# EAGLE schematic maple-audio-r1 (EAGLE 5.04)

## Sheet 1 of 3
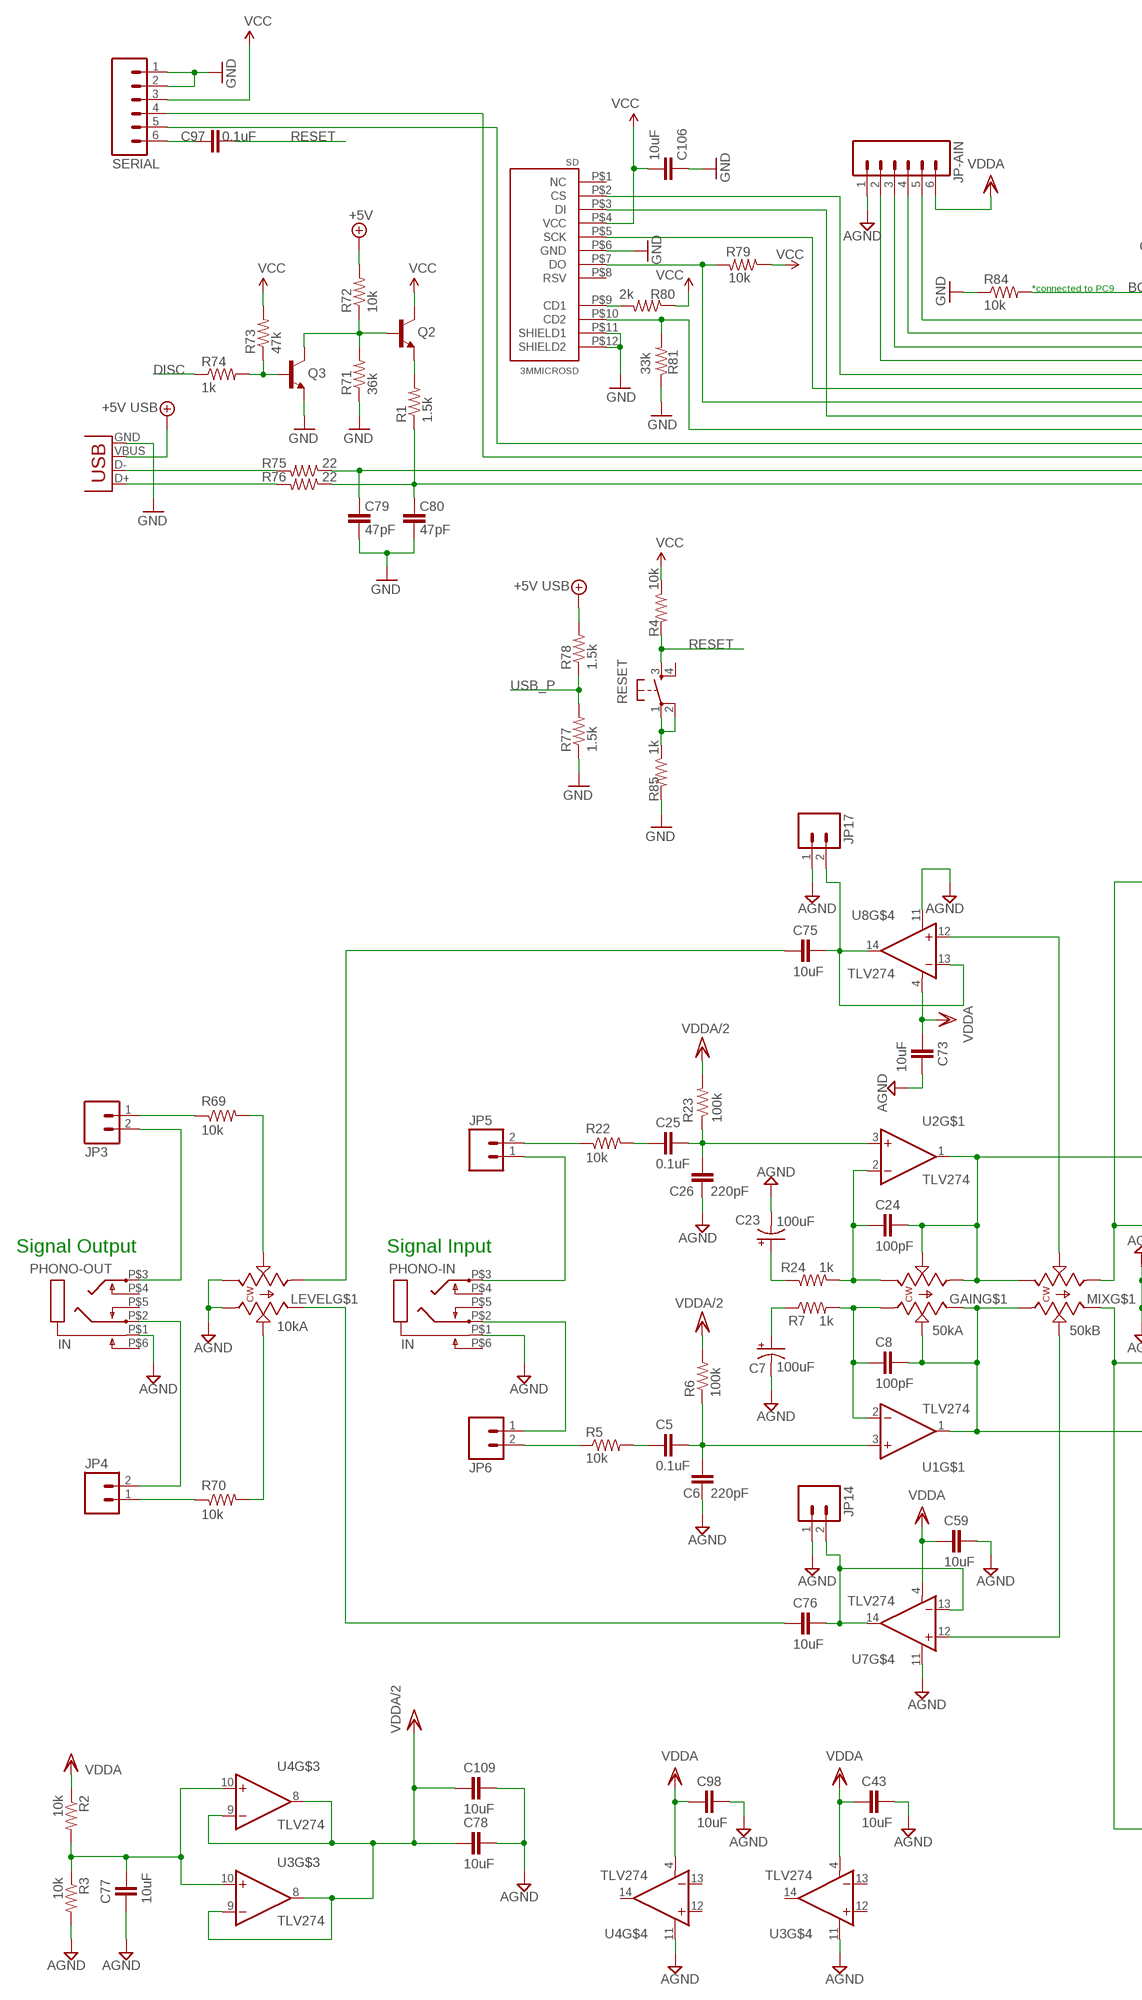
[diagram p0: schematic, sheet 1, part 1 of 2]
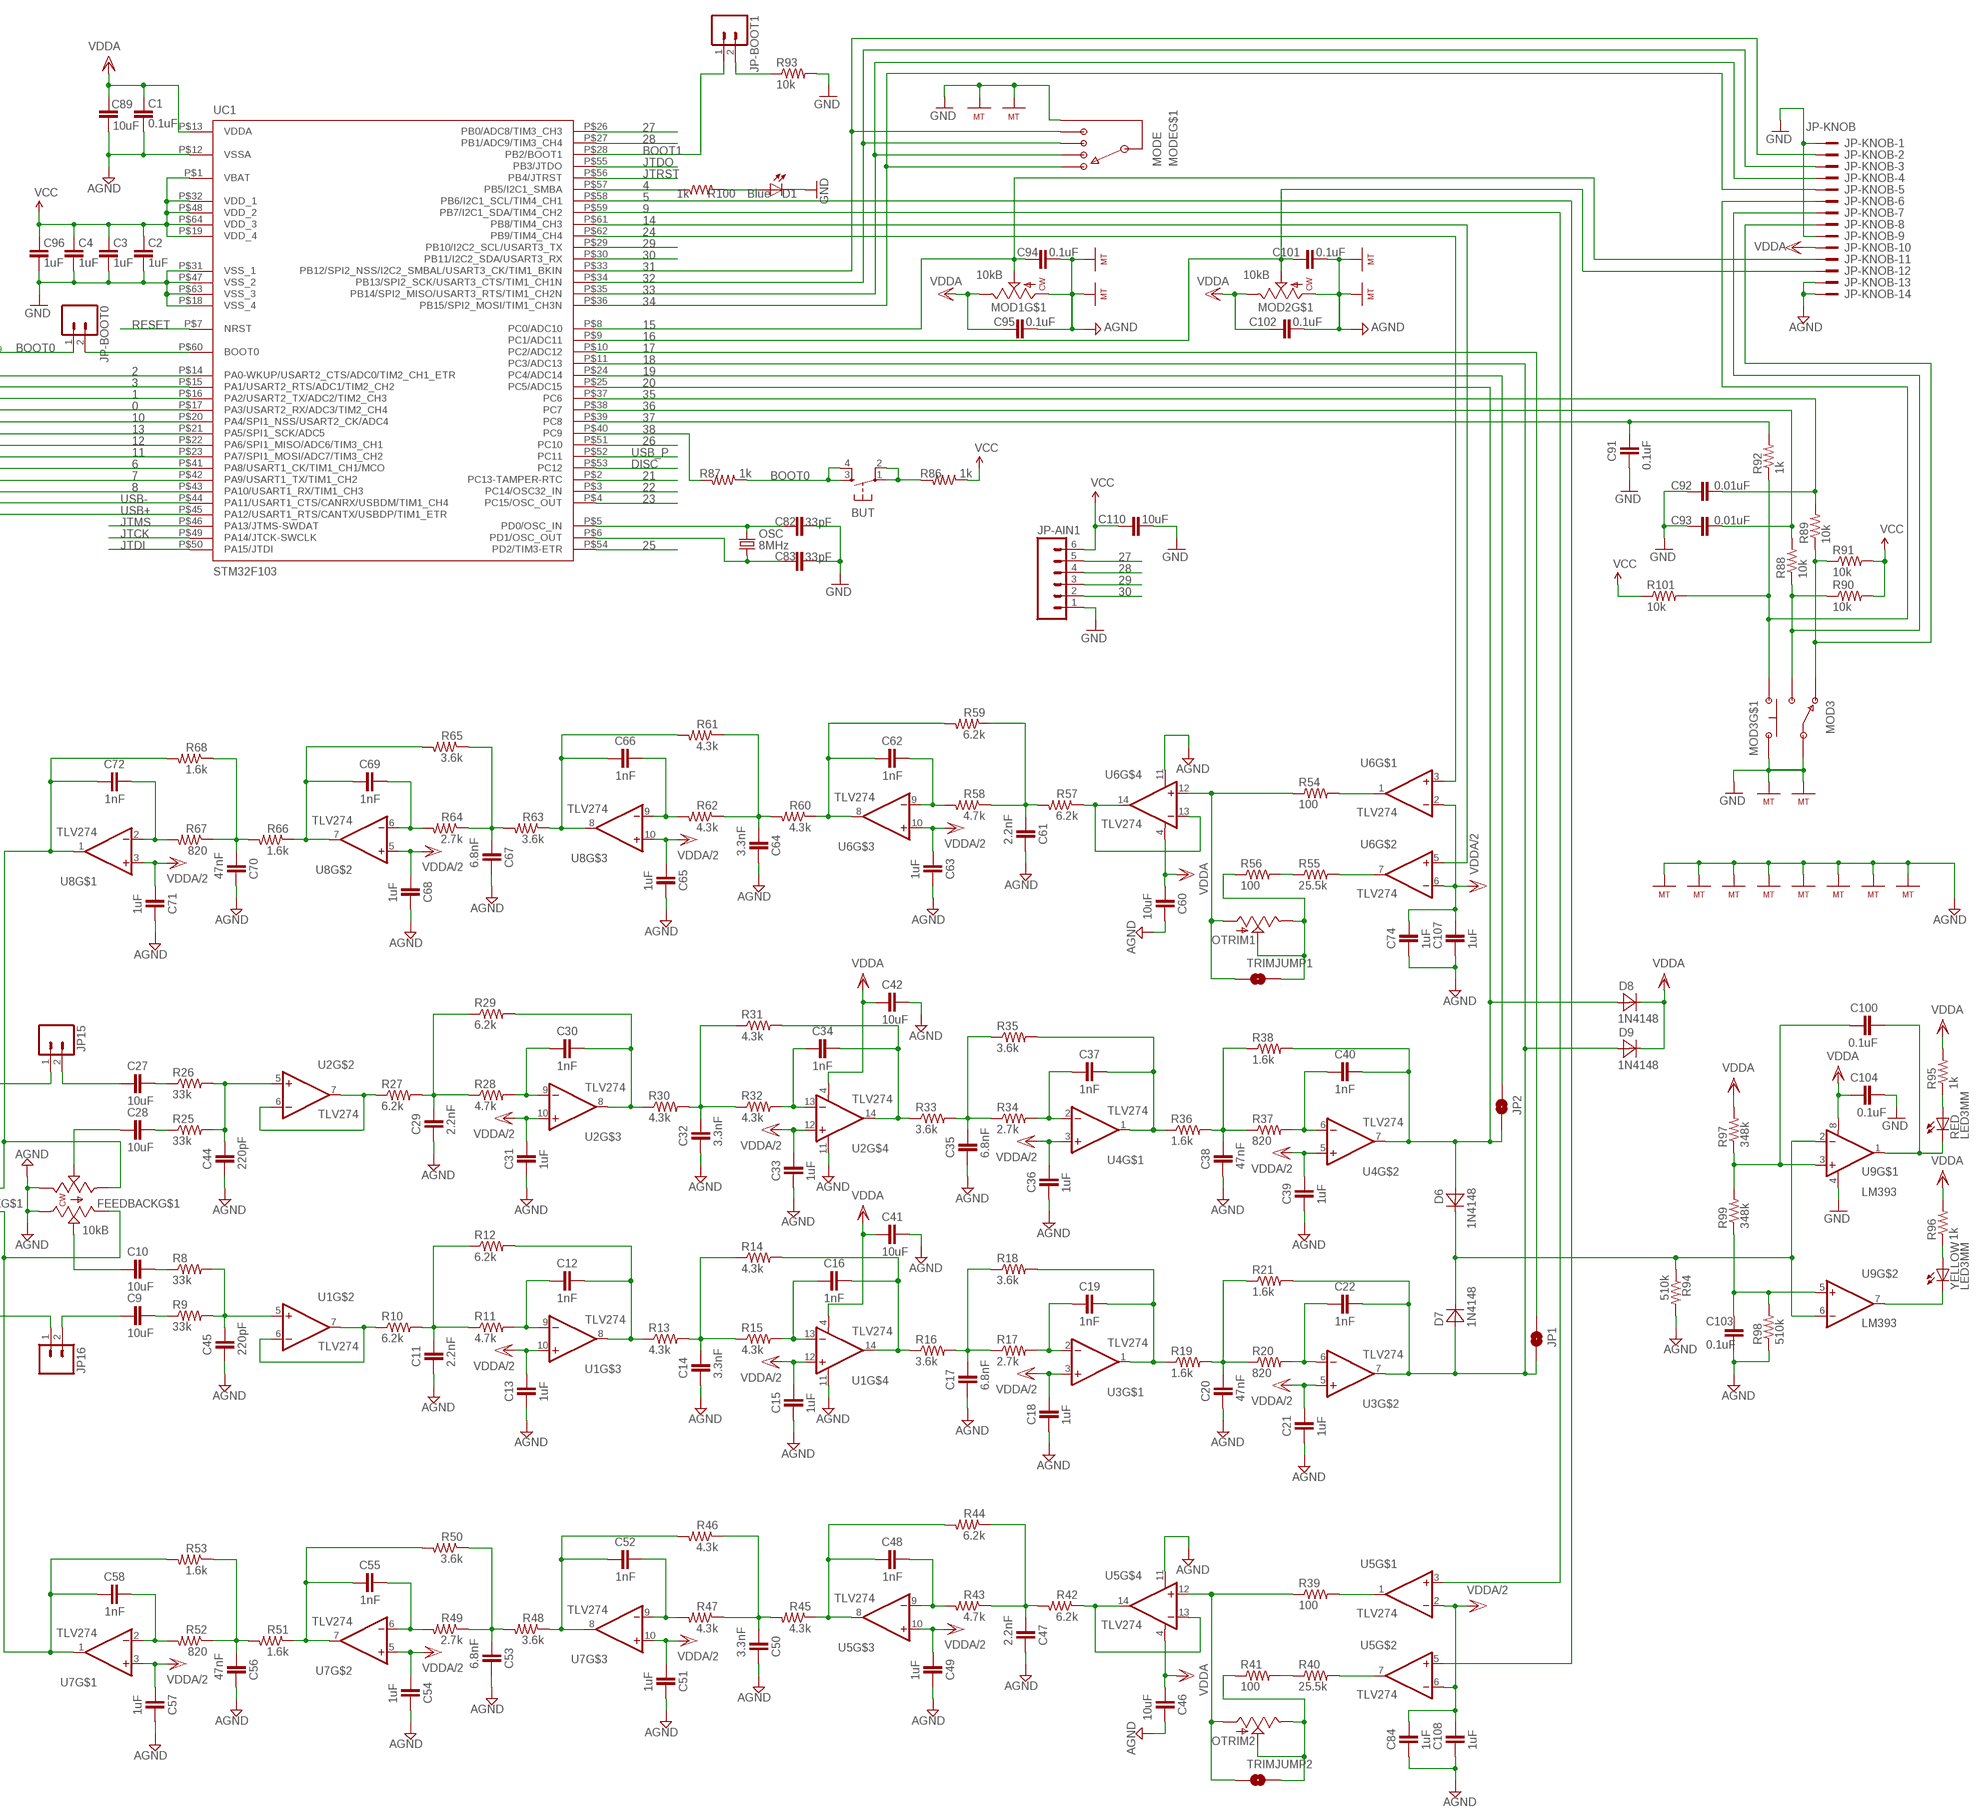
[diagram p1: schematic, sheet 1, part 2 of 2]

### Parts
BUT  TAC_SWITCHPTH  [TACTILE-PTH]
C1  0.1uF  CAP0402  [C0402]
C2  1uF  CAP0402  [C0402]
C3  1uF  CAP0402  [C0402]
C4  1uF  CAP0402  [C0402]
C5  0.1uF  CAPACITOR0805  [0805A]
C6  220pF  CAPACITOR0805  [0805A]
C7  100uF  CAPACITOR-POL  [3528-21]
C8  100pF  CAPACITOR0805  [0805A]
C9  10uF  CAPACITOR0805  [0805A]
C10  10uF  CAPACITOR0805  [0805A]
C11  2.2nF  CAPACITOR0805  [0805A]
C12  1nF  CAPACITOR0805  [0805A]
C13  1uF  CAPACITOR0805  [0805A]
C14  3.3nF  CAPACITOR0805  [0805A]
C15  1uF  CAPACITOR0805  [0805A]
C16  1nF  CAPACITOR0805  [0805A]
C17  6.8nF  CAPACITOR0805  [0805A]
C18  1uF  CAPACITOR0805  [0805A]
C19  1nF  CAPACITOR0805  [0805A]
C20  47nF  CAPACITOR0805  [0805A]
C21  1uF  CAPACITOR0805  [0805A]
C22  1nF  CAPACITOR0805  [0805A]
C23  100uF  CAPACITOR-POL  [3528-21]
C24  100pF  CAPACITOR0805  [0805A]
C25  0.1uF  CAPACITOR0805  [0805A]
C26  220pF  CAPACITOR0805  [0805A]
C27  10uF  CAPACITOR0805  [0805A]
C28  10uF  CAPACITOR0805  [0805A]
C29  2.2nF  CAPACITOR0805  [0805A]
C30  1nF  CAPACITOR0805  [0805A]
C31  1uF  CAPACITOR0805  [0805A]
C32  3.3nF  CAPACITOR0805  [0805A]
C33  1uF  CAPACITOR0805  [0805A]
C34  1nF  CAPACITOR0805  [0805A]
C35  6.8nF  CAPACITOR0805  [0805A]
C36  1uF  CAPACITOR0805  [0805A]
C37  1nF  CAPACITOR0805  [0805A]
C38  47nF  CAPACITOR0805  [0805A]
C39  1uF  CAPACITOR0805  [0805A]
C40  1nF  CAPACITOR0805  [0805A]
C41  10uF  CAPACITOR0805  [0805A]
C42  10uF  CAPACITOR0805  [0805A]
C43  10uF  CAPACITOR0805  [0805A]
C44  220pF  CAPACITOR0805  [0805A]
C45  220pF  CAPACITOR0805  [0805A]
C46  10uF  CAPACITOR0805  [0805A]
C47  2.2nF  CAPACITOR0805  [0805A]
C48  1nF  CAPACITOR0805  [0805A]
C49  1uF  CAPACITOR0805  [0805A]
C50  3.3nF  CAPACITOR0805  [0805A]
C51  1uF  CAPACITOR0805  [0805A]
C52  1nF  CAPACITOR0805  [0805A]
C53  6.8nF  CAPACITOR0805  [0805A]
C54  1uF  CAPACITOR0805  [0805A]
C55  1nF  CAPACITOR0805  [0805A]
C56  47nF  CAPACITOR0805  [0805A]
C57  1uF  CAPACITOR0805  [0805A]
C58  1nF  CAPACITOR0805  [0805A]
C59  10uF  CAPACITOR0805  [0805A]
C60  10uF  CAPACITOR0805  [0805A]
C61  2.2nF  CAPACITOR0805  [0805A]
C62  1nF  CAPACITOR0805  [0805A]
C63  1uF  CAPACITOR0805  [0805A]
C64  3.3nF  CAPACITOR0805  [0805A]
C65  1uF  CAPACITOR0805  [0805A]
C66  1nF  CAPACITOR0805  [0805A]
C67  6.8nF  CAPACITOR0805  [0805A]
C68  1uF  CAPACITOR0805  [0805A]
C69  1nF  CAPACITOR0805  [0805A]
C70  47nF  CAPACITOR0805  [0805A]
C71  1uF  CAPACITOR0805  [0805A]
C72  1nF  CAPACITOR0805  [0805A]
C73  10uF  CAPACITOR0805  [0805A]
C74  1uF  CAPACITOR0805  [0805A]
C75  10uF  CAPACITOR0805  [0805A]
C76  10uF  CAPACITOR0805  [0805A]
C77  10uF  CAPACITOR0805  [0805A]
C78  10uF  CAPACITOR0805  [0805A]
C79  47pF  CAP0402  [C0402]
C80  47pF  CAP0402  [C0402]
C82  33pF  CAP0402  [C0402]
C83  33pF  CAP0402  [C0402]
C84  1uF  CAPACITOR0805  [0805A]
C89  10uF  CAPACITOR0805  [0805A]
C91  0.1uF  CAPACITOR0805  [0805A]
C92  0.01uF  CAPACITOR0805  [0805A]
C93  0.01uF  CAPACITOR0805  [0805A]
C94  0.1uF  CAPACITOR0805  [0805A]
C95  0.1uF  CAPACITOR0805  [0805A]
C96  1uF  CAP0402  [C0402]
C97  0.1uF  CAP0402  [C0402]
C98  10uF  CAPACITOR0805  [0805A]
C100  0.1uF  CAPACITOR0805  [0805A]
C101  0.1uF  CAPACITOR0805  [0805A]
C102  0.1uF  CAPACITOR0805  [0805A]
C103  0.1uF  CAPACITOR0805  [0805A]
C104  0.1uF  CAPACITOR0805  [0805A]
C106  10uF  C-EUC0805  [C0805]
C107  1uF  CAPACITOR0805  [0805A]
C108  1uF  CAPACITOR0805  [0805A]
C109  10uF  CAPACITOR0805  [0805A]
C110  10uF  CAPACITOR0805  [0805A]
D1  Blue  LED3MM  [LED3MM]
D6  1N4148  DIODESOD-123  [SOD-123]
D7  1N4148  DIODESOD-123  [SOD-123]
D8  1N4148  DIODESOD-123  [SOD-123]
D9  1N4148  DIODESOD-123  [SOD-123]
FEEDBACK  10kB  POT-DUALPANASONIC  [POT/DUAL/VERT]
GAIN  50kA  POT-DUALPANASONIC  [POT/DUAL/VERT]
JP1  SOLDERJUMPERTRACE  [SJ_2S-TRACE]
JP2  SOLDERJUMPERTRACE  [SJ_2S-TRACE]
JP3  M02PTH  [1X02]
JP4  M02PTH  [1X02]
JP5  M02PTH  [1X02]
JP6  M02PTH  [1X02]
JP14  M02PTH  [1X02]
JP15  M02PTH  [1X02]
JP16  M02PTH  [1X02]
JP17  M02PTH  [1X02]
JP-AIN  M06SIP  [1X06]
JP-AIN1  M06SIP  [1X06]
JP-BOOT0  M02LOCK  [1X02_LOCK]
JP-BOOT1  M02LOCK  [1X02_LOCK]
JP-KNOB  JP-KNOB  2514-  [PAK100/2500-14]
LEVEL  10kA  POT-DUALPANASONIC  [POT/DUAL/VERT]
MIX  50kB  POT-DUALPANASONIC  [POT/DUAL/VERT]
MOD1  10kB  POTPANASONIC  [POT/SINGLE/PANASONIC]
MOD2  10kB  POTPANASONIC  [POT/SINGLE/PANASONIC]
MOD3  MOD3  ROTARY-ENCODER/SWITCHSWITCH  [ROTARY-ENCODER]
MODE  MODE  ROTARY-ENCODER/BINARYALPHA  [ROTARY-ENCODER/BINARY]
OSC  8MHz  CRYSTAL5X3  [CRYSTAL-SMD-5X3]
OTRIM1  POT100K_3362U  [3362U]
OTRIM2  POT100K_3362U  [3362U]
PHONO-IN  IN  1/4"JACK/STEREO/SWITCHEDNYS-216  [1/4"JACK/STEREO]
PHONO-OUT  IN  1/4"JACK/STEREO/SWITCHEDNYS-216  [1/4"JACK/STEREO]
Q2  TRANSISTOR_NPNSOT23  [SOT23]
Q3  TRANSISTOR_NPNSOT23  [SOT23]
R1  1.5k  RESISTOR0402  [C0402]
R2  10k  R-US_M0805  [M0805]
R3  10k  R-US_M0805  [M0805]
R4  10k  RESISTOR0402  [C0402]
R5  10k  R-US_M0805  [M0805]
R6  100k  R-US_M0805  [M0805]
R7  1k  R-US_M0805  [M0805]
R8  33k  R-US_M0805  [M0805]
R9  33k  R-US_M0805  [M0805]
R10  6.2k  R-US_M0805  [M0805]
R11  4.7k  R-US_M0805  [M0805]
R12  6.2k  R-US_M0805  [M0805]
R13  4.3k  R-US_M0805  [M0805]
R14  4.3k  R-US_M0805  [M0805]
R15  4.3k  R-US_M0805  [M0805]
R16  3.6k  R-US_M0805  [M0805]
R17  2.7k  R-US_M0805  [M0805]
R18  3.6k  R-US_M0805  [M0805]
R19  1.6k  R-US_M0805  [M0805]
R20  820  R-US_M0805  [M0805]
R21  1.6k  R-US_M0805  [M0805]
R22  10k  R-US_M0805  [M0805]
R23  100k  R-US_M0805  [M0805]
R24  1k  R-US_M0805  [M0805]
R25  33k  R-US_M0805  [M0805]
R26  33k  R-US_M0805  [M0805]
R27  6.2k  R-US_M0805  [M0805]
R28  4.7k  R-US_M0805  [M0805]
R29  6.2k  R-US_M0805  [M0805]
R30  4.3k  R-US_M0805  [M0805]
R31  4.3k  R-US_M0805  [M0805]
R32  4.3k  R-US_M0805  [M0805]
R33  3.6k  R-US_M0805  [M0805]
R34  2.7k  R-US_M0805  [M0805]
R35  3.6k  R-US_M0805  [M0805]
R36  1.6k  R-US_M0805  [M0805]
R37  820  R-US_M0805  [M0805]
R38  1.6k  R-US_M0805  [M0805]
R39  100  R-US_M0805  [M0805]
R40  25.5k  R-US_M0805  [M0805]
R41  100  R-US_M0805  [M0805]
R42  6.2k  R-US_M0805  [M0805]
R43  4.7k  R-US_M0805  [M0805]
R44  6.2k  R-US_M0805  [M0805]
R45  4.3k  R-US_M0805  [M0805]
R46  4.3k  R-US_M0805  [M0805]
R47  4.3k  R-US_M0805  [M0805]
R48  3.6k  R-US_M0805  [M0805]
R49  2.7k  R-US_M0805  [M0805]
R50  3.6k  R-US_M0805  [M0805]
R51  1.6k  R-US_M0805  [M0805]
R52  820  R-US_M0805  [M0805]
R53  1.6k  R-US_M0805  [M0805]
R54  100  R-US_M0805  [M0805]
R55  25.5k  R-US_M0805  [M0805]
R56  100  R-US_M0805  [M0805]
R57  6.2k  R-US_M0805  [M0805]
R58  4.7k  R-US_M0805  [M0805]
R59  6.2k  R-US_M0805  [M0805]
R60  4.3k  R-US_M0805  [M0805]
R61  4.3k  R-US_M0805  [M0805]
R62  4.3k  R-US_M0805  [M0805]
R63  3.6k  R-US_M0805  [M0805]
R64  2.7k  R-US_M0805  [M0805]
R65  3.6k  R-US_M0805  [M0805]
R66  1.6k  R-US_M0805  [M0805]
R67  820  R-US_M0805  [M0805]
R68  1.6k  R-US_M0805  [M0805]
R69  10k  R-US_M0805  [M0805]
R70  10k  R-US_M0805  [M0805]
R71  36k  RESISTOR0402  [C0402]
R72  10k  RESISTOR0402  [C0402]
R73  47k  RESISTOR0402  [C0402]
R74  1k  RESISTOR0402  [C0402]
R75  22  RESISTOR0402  [C0402]
R76  22  RESISTOR0402  [C0402]
R77  1.5k  RESISTOR0402  [C0402]
R78  1.5k  RESISTOR0402  [C0402]
R79  10k  R-US_M0805  [M0805]
R80  2k  R-US_M0805  [M0805]
R81  33k  R-US_M0805  [M0805]
R84  10k  RESISTOR0402  [C0402]
R85  1k  RESISTOR0402  [C0402]
R86  1k  RESISTOR0402  [C0402]
R87  1k  RESISTOR0402  [C0402]
R88  10k  RESISTOR0805  [0805A]
R89  10k  RESISTOR0805  [0805A]
R90  10k  RESISTOR0805  [0805A]
R91  10k  RESISTOR0805  [0805A]
R92  1k  RESISTOR0805  [0805A]
R93  10k  RESISTOR0402  [C0402]
R94  510k  RESISTOR0805  [0805A]
R95  1k  RESISTOR0805  [0805A]
R96  1k  RESISTOR0805  [0805A]
R97  348k  RESISTOR0805  [0805A]
R98  510k  RESISTOR0805  [0805A]
R99  348k  RESISTOR0805  [0805A]
R100  1k  RESISTOR0603  [0603]
R101  10k  RESISTOR0805  [0805A]
RED  LED3MM  [LED3MM]
RESET  TAC_SWITCHPTH  [TACTILE-PTH]
SD  3MMICROSD  [3MMICROSD]
SERIAL  M06SMD-FEMALE-V2  [1X06-SMD-FEMALE-V2]
TRIMJUMP1  SOLDERJUMPERNO  [SJ_2S-NO]
TRIMJUMP2  SOLDERJUMPERNO  [SJ_2S-NO]
U1  TLV274  [14-PDIP]
U2  TLV274  [14-PDIP]
U3  TLV274  [14-PDIP]
U4  TLV274  [14-PDIP]
U5  TLV274  [14-PDIP]
U6  TLV274  [14-PDIP]
U7  TLV274  [14-PDIP]
U8  TLV274  [14-PDIP]
U9  LM393  COMPARATOR8-SOIC  [8-SOIC]
UC1  STM32F103  [TQFP-10X10-64]
X1  USBPTH  [USB-B-PTH]
YELLOW  LED3MM  [LED3MM]

### Nets
0: JP-AIN.2 UC1.P$17(PA3/USART2_RX/ADC3/TIM2_CH4)
1: JP-AIN.3 UC1.P$16(PA2/USART2_TX/ADC2/TIM2_CH3)
2: JP-AIN.5 UC1.P$14(PA0-WKUP/USART2_CTS/ADC0/TIM2_CH1_ETR)
3: JP-AIN.4 UC1.P$15(PA1/USART2_RTS/ADC1/TIM2_CH2)
4: R100.1 UC1.P$57(PB5/I2C1_SMBA)
5: U5.5(+IN) UC1.P$58(PB6/I2C1_SCL/TIM4_CH1)
6: R81.2 SD.P$10(CD2) UC1.P$41(PA8/USART1_CK/TIM1_CH1/MCO)
7: SERIAL.5 UC1.P$42(PA9/USART1_TX/TIM1_CH2)
8: SERIAL.4 UC1.P$43(PA10/USART1_RX/TIM1_CH3)
9: U5.3(+IN) UC1.P$59(PB7/I2C1_SDA/TIM4_CH2)
10: SD.P$2(CS) UC1.P$20(PA4/SPI1_NSS/USART2_CK/ADC4)
11: SD.P$3(DI) UC1.P$23(PA7/SPI1_MOSI/ADC7/TIM3_CH2)
12: R79.2 SD.P$7(DO) UC1.P$22(PA6/SPI1_MISO/ADC6/TIM3_CH1)
13: SD.P$5(SCK) UC1.P$21(PA5/SPI1_SCK/ADC5)
14: U6.5(+IN) UC1.P$61(PB8/TIM4_CH3)
15: C94.+ JP-KNOB.11 MOD1.P$1(S) UC1.P$8(PC0/ADC10)
16: C101.+ JP-KNOB.12 MOD2.P$1(S) UC1.P$9(PC1/ADC11)
17: JP1.1 UC1.P$10(PC2/ADC12)
18: C22.+ D7.P$2(A) D9.P$2(A) JP1.2 R21.2 U3.7(OUT) UC1.P$11(PC3/ADC13)
19: JP2.1 UC1.P$24(PC4/ADC14)
20: C40.+ D6.P$2(A) D8.P$2(A) JP2.2 R38.2 U4.7(OUT) UC1.P$25(PC5/ADC15)
21: UC1.P$2(PC13-TAMPER-RTC)
22: UC1.P$3(PC14/OSC32_IN)
23: UC1.P$4(PC15/OSC_OUT)
24: U6.3(+IN) UC1.P$62(PB9/TIM4_CH4)
25: UC1.P$54(PD2/TIM3-ETR)
26: UC1.P$51(PC10)
27: JP-AIN1.5 UC1.P$26(PB0/ADC8/TIM3_CH3)
28: JP-AIN1.4 UC1.P$27(PB1/ADC9/TIM3_CH4)
29: JP-AIN1.3 UC1.P$29(PB10/I2C2_SCL/USART3_TX)
30: JP-AIN1.2 UC1.P$30(PB11/I2C2_SDA/USART3_RX)
31: JP-KNOB.2 MODE.P$4 UC1.P$33(PB12/SPI2_NSS/I2C2_SMBAL/USART3_CK/TIM1_BKIN)
32: JP-KNOB.3 MODE.P$3 UC1.P$34(PB13/SPI2_SCK/USART3_CTS/TIM1_CH1N)
33: JP-KNOB.4 MODE.P$2 UC1.P$35(PB14/SPI2_MISO/USART3_RTS/TIM1_CH2N)
34: JP-KNOB.5 MODE.P$1 UC1.P$36(PB15/SPI2_MOSI/TIM1_CH3N)
35: C92.- R89.- UC1.P$37(PC6)
36: C93.- R88.- UC1.P$38(PC7)
37: C91.- R92.- UC1.P$39(PC8)
38: R87.2 UC1.P$40(PC9)
+5V: R72.2 R78.2 X1.VBUS ; supply symbol labelled +5V USB ; also sheet 2
AGND: JP-AIN.1
BOOT0: BUT.3 BUT.4 JP-BOOT0.1 R84.2 R87.1
BOOT1: JP-BOOT1.1 UC1.P$28(PB2/BOOT1)
DISC: R74.1 UC1.P$53(PC12)
GND [power]: C1.1 C2.1 C3.1 C4.1 C6.- C7.P$2(-) C11.- C13.- C14.- C15.- C17.- C18.- C20.- C21.- C23.P$2(-) C26.- C29.- C31.- C32.- C33.- C35.- C36.- C38.- C39.- C41.+ C42.+ C43.+ C44.- C45.- C46.+ C47.- C49.- C50.- C51.- C53.- C54.- C56.- C57.- C59.+ C60.+ C61.- C63.- C64.- C65.- C67.- C68.- C70.- C71.- C73.+ C74.- C77.- C78.+ C79.1 C80.1 C82.1 C83.1 C84.- C89.- C91.+ C92.+ C93.+ C94.- C95.- C96.1 C98.+ C101.- C102.- C103.+ C104.- C106.1 C107.- C108.- C109.+ C110.- D1.K(C) FEEDBACK.P$4(A) FEEDBACK.P$5(E1) FEEDBACK.P$7(MT) FEEDBACK.P$8(MT) GAIN.P$7(MT) GAIN.P$8(MT) JP14.1 JP17.1 JP-AIN1.1 JP-KNOB.1 JP-KNOB.9 JP-KNOB.13 JP-KNOB.14 LEVEL.P$4(A) LEVEL.P$5(E1) LEVEL.P$7(MT) LEVEL.P$8(MT) MIX.P$7(MT) MIX.P$8(MT) MOD1.P$2(A) MOD1.P$4(MT) MOD1.P$5(MT) MOD2.P$2(A) MOD2.P$4(MT) MOD2.P$5(MT) MOD3.P$1 MOD3.P$4 MOD3.P$6(MT) MOD3.P$7(MT) MODE.P$5 MODE.P$6(MT) MODE.P$7(MT) PHONO-IN.P$1 PHONO-OUT.P$1 Q3.2(E) R3.2 R71.1 R77.1 R81.1 R84.1 R85.2 R93.2 R94.- R98.+ SD.P$6(GND) SD.P$11(SHIELD1) SD.P$12(SHIELD2) SERIAL.1 SERIAL.2 U1.11(V-) U2.11(V-) U3.11(V-) U4.11(V-) U5.11(V-) U6.11(V-) U7.11(V-) U8.11(V-) U9.4(V-) UC1.P$12(VSSA) UC1.P$18(VSS_4) UC1.P$31(VSS_1) UC1.P$47(VSS_2) UC1.P$63(VSS_3) X1.GND ; supply symbol labelled AGND ; also sheet 2,3
JTCK: UC1.P$49(PA14/JTCK-SWCLK) ; also sheet 3
JTDI: UC1.P$50(PA15/JTDI) ; also sheet 3
JTDO: UC1.P$55(PB3/JTDO) ; also sheet 3
JTMS: UC1.P$46(PA13/JTMS-SWDAT) ; also sheet 3
JTRST: UC1.P$56(PB4/JTRST) ; also sheet 3
N$1: C82.2 OSC.3 UC1.P$5(PD0/OSC_IN)
N$2: C5.- R5.2
N$3: C5.+ C6.+ R6.1 U1.3(+IN)
N$4: C7.P$1(+) R7.1
N$5: JP6.2 R5.1
N$6: JP6.1 PHONO-IN.P$2
N$7: C83.2 OSC.1 UC1.P$6(PD1/OSC_OUT)
N$8: C8.- GAIN.P$5(E1) R7.2 U1.2(-IN)
N$9: C10.+ R8.1
N$10: C10.- FEEDBACK.P$6(S1)
N$11: C9.+ R9.1
N$12: C45.+ R8.2 R9.2 U1.5(+IN)
N$13: Q2.2(E) R1.2
N$14: R10.1 U1.6(-IN) U1.7(OUT)
N$15: C11.+ R10.2 R11.1 R12.1
N$16: Q2.1(B) Q3.3(C) R71.2 R72.1
N$17: C12.- R11.2 U1.9(-IN)
N$18: C12.+ R12.2 R13.1 U1.8(OUT)
N$19: C14.+ R13.2 R14.1 R15.1
N$20: C16.- R15.2 U1.13(-IN)
N$21: C16.+ R14.2 R16.1 U1.14(OUT)
N$22: C77.+ R2.2 R3.1 U3.10(+IN) U4.10(+IN)
N$23: C17.+ R16.2 R17.1 R18.1
N$24: R80.2 SD.P$9(CD1)
N$25: C19.- R17.2 U3.2(-IN)
N$26: C19.+ R18.2 R19.1 U3.1(OUT)
N$27: C20.+ R19.2 R20.1 R21.1
N$28: C22.- R20.2 U3.6(-IN)
N$30: C25.- R22.2
N$31: C8.+ GAIN.P$1(A1) GAIN.P$6(S1) JP16.1 MIX.P$5(E1) U1.1(OUT)
N$32: C25.+ C26.+ R23.1 U2.3(+IN)
N$33: C24.+ GAIN.P$2(E) GAIN.P$3(S) JP15.1 MIX.P$4(A) U2.1(OUT)
N$34: C23.P$1(+) R24.1
N$35: C24.- GAIN.P$4(A) R24.2 U2.2(-IN)
N$36: Q3.1(B) R73.1 R74.2
N$37: C28.- FEEDBACK.P$3(S)
N$38: C28.+ R25.1
N$39: C27.+ R26.1
N$40: C44.+ R25.2 R26.2 U2.5(+IN)
N$41: R27.1 U2.6(-IN) U2.7(OUT)
N$42: C29.+ R27.2 R28.1 R29.1
N$43: C30.- R28.2 U2.9(-IN)
N$44: C30.+ R29.2 R30.1 U2.8(OUT)
N$45: C32.+ R30.2 R31.1 R32.1
N$46: C34.- R32.2 U2.13(-IN)
N$47: C34.+ R31.2 R33.1 U2.14(OUT)
N$48: C35.+ R33.2 R34.1 R35.1
N$49: C37.- R34.2 U4.2(-IN)
N$50: C37.+ R35.2 R36.1 U4.1(OUT)
N$51: C38.+ R36.2 R37.1 R38.1
N$52: C40.- R37.2 U4.6(-IN)
N$53: R39.2 U5.1(OUT)
N$54: R40.2 U5.7(OUT)
N$55: R40.1 R41.2
N$56: OTRIM2.P$3(A) R39.1 TRIMJUMP2.1 U5.12(+IN)
N$57: D1.A R100.2
N$58: R42.1 U5.13(-IN) U5.14(OUT)
N$59: C47.+ R42.2 R43.1 R44.1
N$60: C48.- R43.2 U5.9(-IN)
N$61: C48.+ R44.2 R45.1 U5.8(OUT)
N$62: C50.+ R45.2 R46.1 R47.1
N$63: C52.- R47.2 U7.9(-IN)
N$64: C52.+ R46.2 R48.1 U7.8(OUT)
N$65: C53.+ R48.2 R49.1 R50.1
N$66: C55.- R49.2 U7.6(-IN)
N$67: C55.+ R50.2 R51.1 U7.7(OUT)
N$68: C56.+ R51.2 R52.1 R53.1
N$69: C58.- R52.2 U7.2(-IN)
N$70: R55.2 U6.7(OUT)
N$71: R55.1 R56.2
N$72: OTRIM1.P$3(A) R54.1 TRIMJUMP1.1 U6.12(+IN)
N$73: R57.1 U6.13(-IN) U6.14(OUT)
N$74: C61.+ R57.2 R58.1 R59.1
N$75: C62.- R58.2 U6.9(-IN)
N$76: C62.+ R59.2 R60.1 U6.8(OUT)
N$77: C64.+ R60.2 R61.1 R62.1
N$78: C66.- R62.2 U8.9(-IN)
N$79: C66.+ R61.2 R63.1 U8.8(OUT)
N$80: C67.+ R63.2 R64.1 R65.1
N$81: C69.- R64.2 U8.6(-IN)
N$82: C69.+ R65.2 R66.1 U8.7(OUT)
N$83: C70.+ R66.2 R67.1 R68.1
N$84: C72.- R67.2 U8.2(-IN)
N$85: MIX.P$6(S1) U7.12(+IN)
N$86: JP3.1 R69.1
N$87: C75.+ JP17.2 U8.13(-IN) U8.14(OUT)
N$88: C76.- LEVEL.P$1(A1)
N$89: C75.- LEVEL.P$2(E)
N$90: MIX.P$3(S) U8.12(+IN)
N$91: R75.2 X1.D-
N$92: LEVEL.P$3(S) R69.2
N$93: LEVEL.P$6(S1) R70.2
N$94: JP4.2 PHONO-OUT.P$2
N$96: R76.2 X1.D+
N$108 [power]: R85.1 RESET.1 RESET.2
N$109: BUT.1 BUT.2 R86.2
N$110: JP-BOOT0.2 UC1.P$60(BOOT0)
N$113: D6.P$1(C) D7.P$1(C) R94.+ U9.2(-IN) U9.6(-IN)
N$114: C97.2 SERIAL.6
N$115: JP-KNOB.7 MOD3.P$3 R88.+ R90.+
N$116: C103.- R98.- R99.+ U9.5(+IN)
N$117: C100.- RED.K(C) U9.1(OUT)
N$118: U9.7(OUT) YELLOW.K(C)
N$119: R95.+ RED.A
N$120: R96.+ YELLOW.A
N$122: C100.+ R97.+ R99.- U9.3(+IN)
N$124: OTRIM1.P$1(E) OTRIM1.P$2(S) R56.1 TRIMJUMP1.2
N$125: JP-BOOT1.2 R93.1
N$126: OTRIM2.P$1(E) OTRIM2.P$2(S) R41.1 TRIMJUMP2.2
N$127: R54.2 U6.1(OUT)
N$129: C76.+ JP14.2 U7.13(-IN) U7.14(OUT)
N$130: JP3.2 PHONO-OUT.P$3
N$131: JP4.1 R70.1
N$132: JP-KNOB.8 MOD3.P$2 R89.+ R91.+
N$133: JP5.1 PHONO-IN.P$3
N$134: JP5.2 R22.1
N$135: C27.- JP15.2
N$136: C9.- JP16.2
N$146: JP-KNOB.6 MOD3.P$5 R92.+ R101.-
PWMOUT1: C72.+ FEEDBACK.P$2(E) MIX.P$2(E) R68.2 U8.1(OUT)
PWMOUT2: C58.+ FEEDBACK.P$1(A1) MIX.P$1(A1) R53.2 U7.1(OUT)
RESET: C97.1 R4.2 RESET.3 UC1.P$7(NRST) ; also sheet 3
USB+: C80.2 R1.1 R76.1 UC1.P$45(PA12/USART1_RTS/CANTX/USBDP/TIM1_ETR)
USB-: C79.2 R75.1 UC1.P$44(PA11/USART1_CTS/CANRX/USBDM/TIM1_CH4)
USB_P: R77.2 R78.1 UC1.P$52(PC11)
VCC: C2.2 C3.2 C4.2 C96.2 C106.2 C110.+ JP-AIN1.6 Q2.3(C) R4.1 R73.2 R79.1 R80.1 R86.1 R90.- R91.- R101.+ SD.P$4(VCC) SERIAL.3 UC1.P$1(VBAT) UC1.P$19(VDD_4) UC1.P$32(VDD_1) UC1.P$48(VDD_2) UC1.P$64(VDD_3) ; also sheet 2,3
VCC/2: C13.+ C15.+ C18.+ C21.+ C31.+ C33.+ C36.+ C39.+ C49.+ C51.+ C54.+ C57.+ C63.+ C65.+ C68.+ C71.+ C74.+ C78.- C84.+ C107.+ C108.+ C109.- R6.2 R23.2 U1.10(+IN) U1.12(+IN) U2.10(+IN) U2.12(+IN) U3.3(+IN) U3.5(+IN) U3.8(OUT) U3.9(-IN) U4.3(+IN) U4.5(+IN) U4.8(OUT) U4.9(-IN) U5.2(-IN) U5.6(-IN) U5.10(+IN) U6.2(-IN) U6.6(-IN) U6.10(+IN) U7.3(+IN) U7.5(+IN) U7.10(+IN) U8.3(+IN) U8.5(+IN) U8.10(+IN) ; supply symbol labelled VDDA/2
VDD: C1.2 C41.- C42.- C43.- C46.- C59.- C60.- C73.- C89.+ C95.+ C98.- C102.+ C104.+ D8.P$1(C) D9.P$1(C) JP-AIN.6 JP-KNOB.10 MOD1.P$3(E) MOD2.P$3(E) R2.1 R95.- R96.- R97.- U1.4(V+) U2.4(V+) U3.4(V+) U4.4(V+) U5.4(V+) U6.4(V+) U7.4(V+) U8.4(V+) U9.8(V+) UC1.P$13(VDDA) ; supply symbol labelled VDDA ; also sheet 2
Unconnected: PHONO-IN.P$4 PHONO-IN.P$5 PHONO-IN.P$6 PHONO-OUT.P$4 PHONO-OUT.P$5 PHONO-OUT.P$6 RESET.4 SD.P$1(NC) SD.P$8(RSV) U3.12(+IN) U3.13(-IN) U3.14(OUT) U4.12(+IN) U4.13(-IN) U4.14(OUT)

### Notes on the sheet
- *connected to PC9
- Signal Output | Signal Input

## Sheet 2 of 3
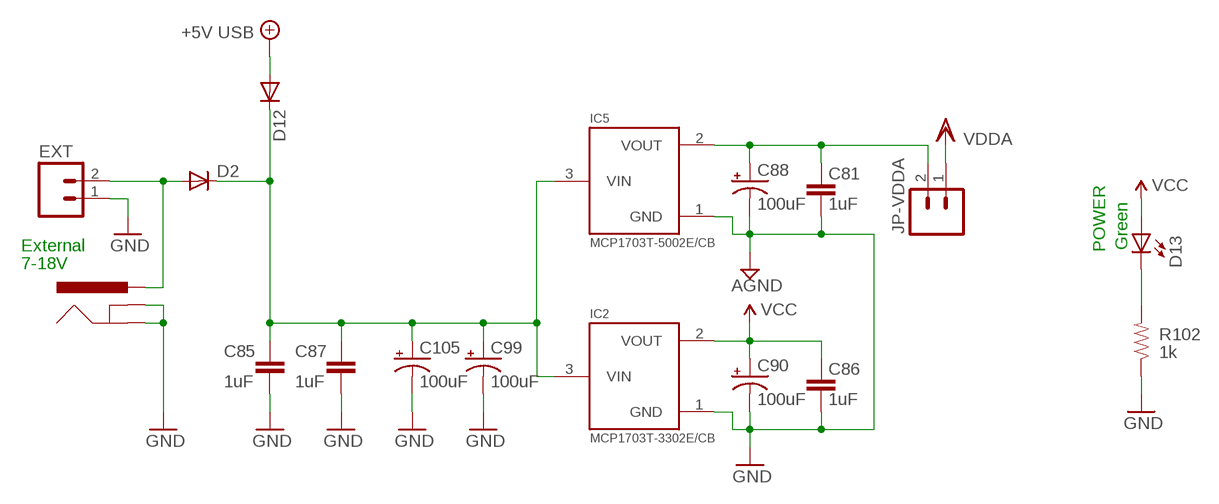
[diagram p2: schematic, sheet 2]

### Parts
C81  1uF  CAP0805  [0805]
C85  1uF  CAP0805  [0805]
C86  1uF  CAP0805  [0805]
C87  1uF  CAP0805  [0805]
C88  100uF  CAP_POLD  [PANASONIC_D]
C90  100uF  CAP_POLD  [PANASONIC_D]
C99  100uF  CAP_POLD  [PANASONIC_D]
C105  100uF  CAP_POLD  [PANASONIC_D]
D2  DIODESMA  [SMA-DIODE]
D12  DIODESMA  [SMA-DIODE]
D13  Green  LED3MM  [LED3MM]
EXT  M02POLAR  [MOLEX-1X2]
EXT-BAR  POWER_JACKPTH  [POWER_JACK_PTH]
IC2  MCP1703T-3302E/CB  MCP1700T  [SOT23]
IC5  MCP1703T-5002E/CB  MCP1700T  [SOT23]
JP-VDDA  M02LOCK  [1X02_LOCK]
R102  1k  RESISTOR0603  [0603]

### Nets
+5V: D12.A ; supply symbol labelled +5V USB ; also sheet 1
GND [power]: C81.1 C85.1 C86.1 C87.1 C88.- C90.- C99.- C105.- EXT-BAR.GND EXT-BAR.GNDBREAK EXT.1 IC2.1(GND) IC5.1(GND) R102.1 ; supply symbol labelled AGND ; also sheet 1,3
N$97 [power]: D2.A EXT-BAR.PWR EXT.2
N$121: C81.2 C88.+ IC5.2(VOUT) JP-VDDA.2
N$137: D13.K(C) R102.2
VCC: C86.2 C90.+ D13.A IC2.2(VOUT) ; also sheet 1,3
VDD: JP-VDDA.1 ; supply symbol labelled VDDA ; also sheet 1
VIN: C85.2 C87.2 C99.+ C105.+ D2.C D12.C IC2.3(VIN) IC5.3(VIN)

### Notes on the sheet
- External | POWER
- 7-18V

## Sheet 3 of 3
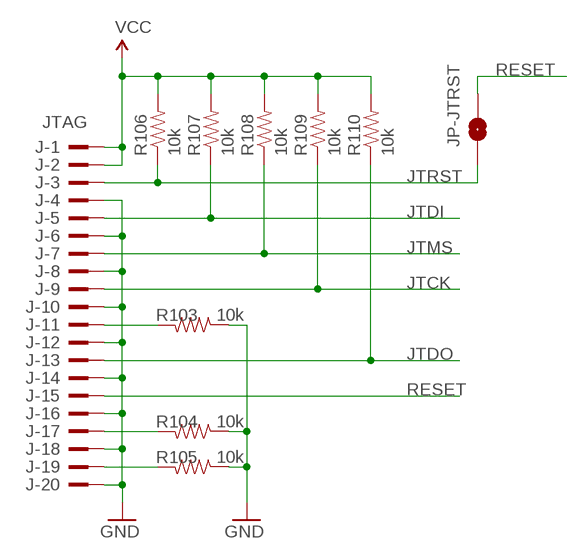
[diagram p3: schematic, sheet 3]

### Parts
J  JTAG  2520-  [PAK100/2500-20]
JP-JTRST  SOLDERJUMPERNO  [SJ_2S-NO]
R103  10k  RESISTOR0402  [C0402]
R104  10k  RESISTOR0402  [C0402]
R105  10k  RESISTOR0402  [C0402]
R106  10k  RESISTOR0402  [C0402]
R107  10k  RESISTOR0402  [C0402]
R108  10k  RESISTOR0402  [C0402]
R109  10k  RESISTOR0402  [C0402]
R110  10k  RESISTOR0402  [C0402]

### Nets
GND [power]: J.4 J.6 J.8 J.10 J.12 J.14 J.16 J.18 J.20 R103.1 R104.1 R105.1 ; also sheet 1,2
JTCK: J.9 R109.1 ; also sheet 1
JTDI: J.5 R107.1 ; also sheet 1
JTDO: J.13 R110.1 ; also sheet 1
JTMS: J.7 R108.1 ; also sheet 1
JTRST: J.3 JP-JTRST.1 R106.1 ; also sheet 1
N$140: J.11 R103.2
N$141: J.17 R104.2
N$142: J.19 R105.2
RESET: J.15 JP-JTRST.2 ; also sheet 1
VCC: J.1 J.2 R106.2 R107.2 R108.2 R109.2 R110.2 ; also sheet 1,2

## Library data of the parts
BUT RESET = SparkFun3:TAC_SWITCH: Momentary Switch Button commonly used for reset or general input. Spark Fun Electronics SKU : COM-00097
C1-C4 C79-C83 C85-C87 C96 C97 = SparkFun:CAP: Capacitor Standard 0603 ceramic capacitor, and 0.1" leaded capacitor.
C5 C6 C8-C22 C24-C78 C84 C89 C91-C95 C98 C100-C104 C107-C110 = audioint:CAPACITOR
C7 C23 = audioint:CAPACITOR-POL
C88 C90 C99 C105 = SparkFun3:CAP_POL: Capacitor Polarized These are standard SMD and PTH capacitors. Normally 10uF, 47uF, and 100uF in electrolytic and tantalum varieties. Always verify the external diameter of the through hole cap, it varies with capacity, voltage, and manufacturer. The EIA devices should be standard.
C106 = rcl:C-EU: CAPACITOR, European symbol
D1 D13 = SparkFun:LED: LEDs Standard schematic elements and footprints for 5mm, 3mm, 1206, and 0603 sized LEDs. 5mm - Spark Fun Electronics SKU : COM-00529 (and others)
D2 D12 = SparkFun3:DIODE: Diode These are standard reverse protection diodes and small signal diodes. SMA package can handle up to about 1A. SOD-323 can handle about 200mA. What the SOD-323 package when ordering, there are some mfgs out there that are 5-pin packages.
D6-D9 = audioint:DIODE
EXT = SparkFun2:M02: Header 2 Standard 2-pin 0.1" header. Use with straight break away headers (SKU : PRT-00116), right angle break away headers (PRT-00553), swiss pins (PRT-00743), machine pins (PRT-00117), and female headers (PRT-00115). Molex polarized connector foot print use with SKU : PRT-08233 with associated crimp pins and housings.
EXT-BAR = SparkFun2:POWER_JACK: Power Jack This is the standard 5.5mm barrel jack for power. The PTH is the most common, proven, reliable, footprint. All others are experimental. The Slot footprint only works if the mill layer is transmitted to the PCB fab house so be warned. Spark Fun Electronics SKU : PRT-00119. Mating wall wart : TOL-00298 (and others)
FEEDBACK GAIN LEVEL MIX = audioint:POT-DUAL
IC2 IC5 = okie:MCP1700T
J = con-3m:2520-: 3M (TM) Pak 100 4-Wall Header Source: 3M
JP1 JP2 JP-JTRST TRIMJUMP1 TRIMJUMP2 = SparkFun3:SOLDERJUMPER: Solder Jumper Standard SMD solder jumper. Used to automate production. Two varients : Normally Open and Normally Closed are the same, but have different paste layers. NC will have a large amount of paste and should jumper during reflow.
JP3-JP6 JP14-JP17 JP-BOOT0 JP-BOOT1 JP-VDDA = SparkFun3:M02: Header 2 Standard 2-pin 0.1" header. Use with straight break away headers (SKU : PRT-00116), right angle break away headers (PRT-00553), swiss pins (PRT-00743), machine pins (PRT-00117), and female headers (PRT-00115). Molex polarized connector foot print use with SKU : PRT-08233 with associated crimp pins and housings.
JP-AIN JP-AIN1 SERIAL = SparkFun3:M06: Header 6 Standard 6-pin 0.1" header. Use with straight break away headers (SKU : PRT-00116), right angle break away headers (PRT-00553), swiss pins (PRT-00743), machine pins (PRT-00117), and female headers (PRT-00115). Molex polarized connector foot print use with SKU : PRT-08094 with associated crimp pins and housings. NOTES ON THE VARIANTS LOCK and LOCK_LONGPADS... This footprint was designed to help hold the alignment of a through-hole component (i.e. 6-pin header) while soldering it into place. You may notice that each hole has been shifted either up or down by 0.005 of an inch from it's more standard position (which is a perfectly straight line). This slight alteration caused the pins (the squares in the middle) to touch the edges of the holes. Because they are alternating, it causes a "brace" to hold the component in place. 0.005 has proven to be the perfect amount of "off-center" position when using our standard breakaway headers. Although looks a little odd when you look at the bare footprint, once you have a header in there, the alteration is very hard to notice. Also, if you push a header all the way into place, it is covered up entirely on the bottom side. This idea of altering the position of holes to aid alignment will be further integrated into the Sparkfun Library for other footprints. It can help hold any component with 3 or more connection pins.
JP-KNOB = con-3m:2514-: 3M (TM) Pak 100 4-Wall Header Source: 3M
MOD1 MOD2 = audioint:POT
MOD3 = audioint:ROTARY-ENCODER/SWITCH
MODE = audioint:ROTARY-ENCODER/BINARY
OSC = SparkFun2:CRYSTAL: Crystals Various standard crystals. Proven footprints. Spark Fun Electronics SKU : COM-00534
OTRIM1 OTRIM2 = SparkFun3:POT
PHONO-IN PHONO-OUT = audioint:1/4"JACK/STEREO/SWITCHED
Q2 Q3 = SparkFun2:TRANSISTOR_NPN: Transistor NPN BJT configuration in SOT23 package. MMBT2222 is the common NPN we use. Double check BCE configuration again layout.
R1 R4 R71-R78 R84-R87 R93 R100 R102-R110 = SparkFun:RESISTOR: Resistor Basic schematic elements and footprints for 0603, 1206, and PTH 1/10th watt (small) resistors.
R2 R3 R5-R70 R79-R81 = rcl:R-US_: RESISTOR, American symbol
R88-R92 R94-R99 R101 = audioint:RESISTOR
RED YELLOW = audioint:LED
SD = okie-adi:3MMICROSD: 2908-05WB-MG
U1-U8 = audioint:TLV274
U9 = audioint:COMPARATOR
UC1 = st-microelectronics:STM32F103
X1 = SparkFun2:USB: USB Connectors USB-B-PTH is fully proven SKU : PRT-00139 USB-miniB is fully proven SKU : PRT-00587 USB-A-PCB is untested. USB-A-H is throughly reviewed, but untested. Spark Fun Electronics SKU : PRT-00437 USB-B-SMT is throughly reviewed, but untested. Needs silkscreen touching up. USB-A-S has not been used/tested USB-MB-H has not been used/tested

## Net classes
0 default: width 0.203 mm
1 power: width 0.203 mm
2 gnd: width 0.305 mm, drill 0.508 mm, clearance 0.152 mm
3 usbvcc: width 0.508 mm, drill 0.508 mm, clearance 0.152 mm